# EasyEDA schematic SCH_Smart-Irrigation-System_2026-05-28.json
TITLE: Sheet_1; REV: 1.0; Date: 2026-05-16; Sheet: 1/1; Drawn By: ninadhazarika; Company: Your Company
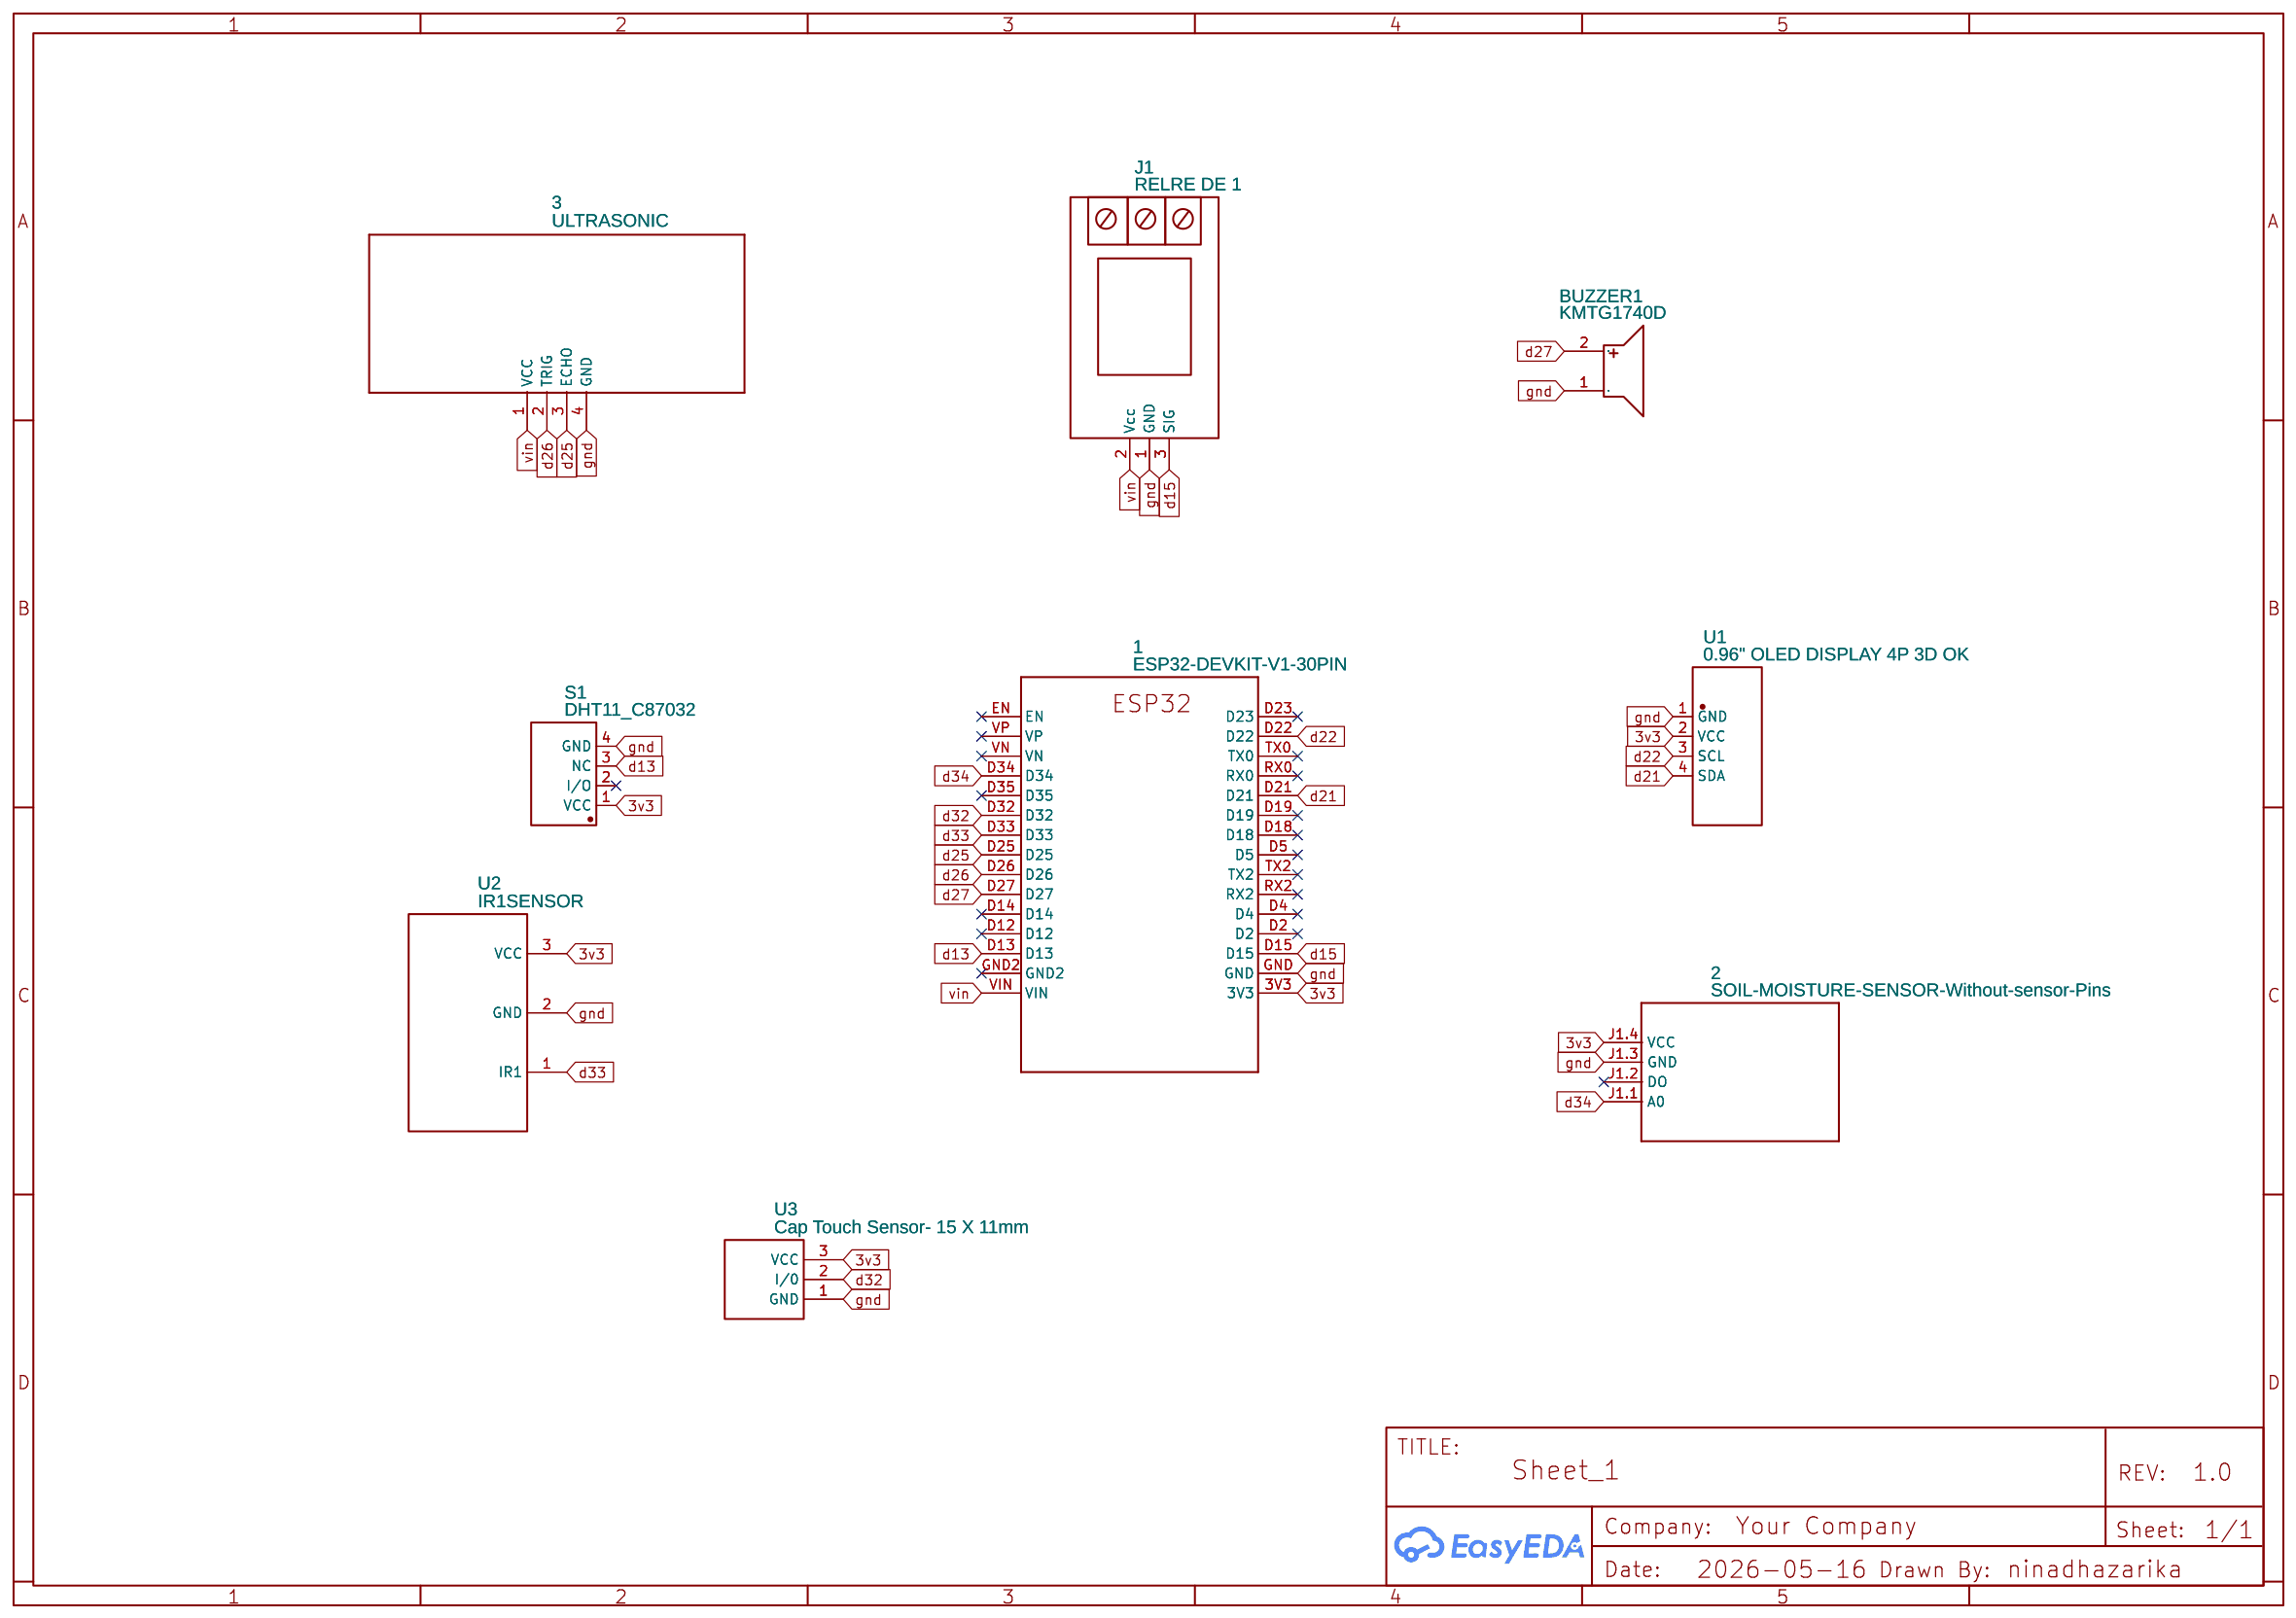
[diagram p0: schematic sheet]

## Parts
1  ESP32-DEVKIT-V1-30PIN  [ESP32-DEVKITV1_ESP32-DEVKITV1]
2  SOIL-MOISTURE-SENSOR-Without-sensor-Pins  [SOIL-MOISTURE-SENSOR-WITHOUT-SENSOR-PINS]
3  ULTRASONIC  [ULTRASONIC-HC-SR04#V]
BUZZER1  KMTG1740D  [BUZZER-SMD_KMTG1740D]
J1  RELRE DE 1  [RELAY MODULE 1 RELAYS]
S1  DHT11_C87032  [SENSOR-TH_DHT11-1]
U1  0.96" OLED DISPLAY 4P 3D OK  [OLED-TH_OLED0.96-SPI]
U2  IR1SENSOR  [IRSENSOR]
U3  Cap Touch Sensor- 15 X 11mm  [CAP TOUCH SENSOR- 15 X 11MM]

## Library data of the parts
1 = ESP32-DEVKIT-V1-30PIN: Contributor: 21010882
2 = SOIL-MOISTURE-SENSOR-Without-sensor-Pins: Contributor: rongarcia
3 = ULTRASONIC: Contributor: hollandacocobear
BUZZER1 = KMTG1740D: Supplier: LCSC; Supplier Part: C7421670; Manufacturer: KINGSTATE(志丰电子); JLCPCB Part Class: Extended Part; Contributor: lcsc
J1 = RELRE DE 1: Manufacturer Part: 1-Channel 5V Relay Module w/ Opto-isolator; Supplier Part: SKU: 223429; link: http://www.volumerate.com/product/1-channel-5v-relay-module-w-opto-isolator-red-blue-223429; Contributor: dtutillo.8804
S1 = DHT11_C87032: Supplier Part: C87032; Supplier: LCSC; Manufacturer: AOSONG; Manufacturer Part: DHT11; JLCPCB Part Class: Extended Part
U1 = 0.96" OLED DISPLAY 4P 3D OK: Supplier Part: C9900027058; Manufacturer: 郑州中景园电子技术有限公司; Manufacturer Part: ZJY096S0700BG01蓝色; link: https://img.jlc.com/pdf/applyPasteComponent/2022-08-15/203417A/337c2d88c1b34c958220578f8c1ccd46/ZJY096S0700WG01.pdf; Contributor: exitte
U2 = IR1SENSOR: Contributor: bat869cube672
U3 = Cap Touch Sensor- 15 X 11mm: Contributor: katiekearns

## Nets
3v3: 1.3V3 2.J1.4(VCC) S1.1(VCC) U1.2(VCC) U2.3(VCC) U3.3(VCC)
gnd: 1.GND 2.J1.3(GND) 3.4(GND) BUZZER1.1 J1.1(GND) S1.4(GND) U1.1(GND) U2.2(GND) U3.1(GND)
vin: 1.VIN 3.1(VCC) J1.2(Vcc)
d13: 1.D13 S1.3(NC)
d15: 1.D15 J1.3(SIG)
d21: 1.D21 U1.4(SDA)
d22: 1.D22 U1.3(SCL)
d25: 1.D25 3.3(ECHO)
d26: 1.D26 3.2(TRIG)
d27: 1.D27 BUZZER1.2
d32: 1.D32 U3.2(I/0)
d33: 1.D33 U2.1(IR1)
d34: 1.D34 2.J1.1(A0)

Not connected (* = marked no-connect by the designer): 1 D2* D4* D5* D12* D14* D18* D19* D23* D35* EN* GND2* RX0* RX2* TX0* TX2* VN* VP*; 2 J1.2(DO)*; S1 2(I/O)*
